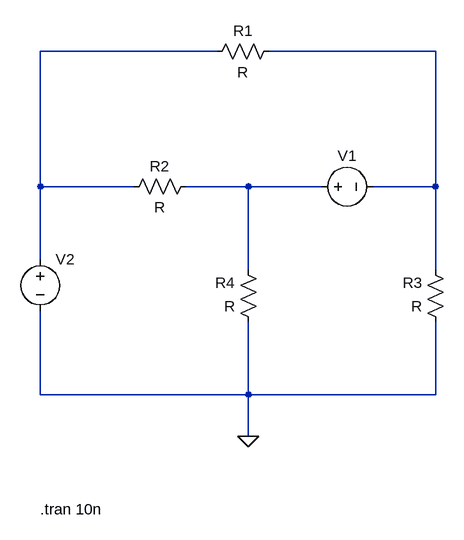
[diagram p0: schematic EE1002_LTSpice_Lab3.asc]
EE1002_LTSpice_Lab3.asc, the LTspice schematic file:
Version 4
SHEET 1 880 752
WIRE 80 32 -192 32
WIRE 416 32 160 32
WIRE -192 240 -192 32
WIRE -48 240 -192 240
WIRE 128 240 32 240
WIRE 240 240 128 240
WIRE 416 240 416 32
WIRE 416 240 320 240
WIRE -192 352 -192 240
WIRE 128 368 128 240
WIRE 416 368 416 240
WIRE -192 560 -192 432
WIRE 128 560 128 448
WIRE 128 560 -192 560
WIRE 416 560 416 448
WIRE 416 560 128 560
WIRE 128 624 128 560
FLAG 128 624 0
SYMBOL res 64 48 R270
WINDOW 0 32 56 VTop 2
WINDOW 3 0 56 VBottom 2
SYMATTR InstName R1
SYMBOL res -64 256 R270
WINDOW 0 32 56 VTop 2
WINDOW 3 0 56 VBottom 2
SYMATTR InstName R2
SYMBOL voltage 224 240 R270
WINDOW 0 32 56 VTop 2
WINDOW 3 -32 56 VBottom 2
WINDOW 123 0 0 Left 2
WINDOW 39 0 0 Left 2
SYMATTR InstName V1
SYMATTR Value ""
SYMBOL voltage -192 336 R0
WINDOW 123 0 0 Left 2
WINDOW 39 0 0 Left 2
SYMATTR InstName V2
SYMATTR Value ""
SYMBOL res 432 464 R180
WINDOW 0 36 76 Left 2
WINDOW 3 36 40 Left 2
SYMATTR InstName R3
SYMBOL res 144 464 R180
WINDOW 0 36 76 Left 2
WINDOW 3 36 40 Left 2
SYMATTR InstName R4
TEXT -192 736 Left 2 !.tran 10n

The netlist it stands for:
* EE1002_LTSpice_Lab3.asc
R1 N001 N002 R
R2 N001 N003 R
V1 N003 N002
V2 N001 0
R3 0 N002 R
R4 0 N003 R
.tran 10n
.backanno
.end